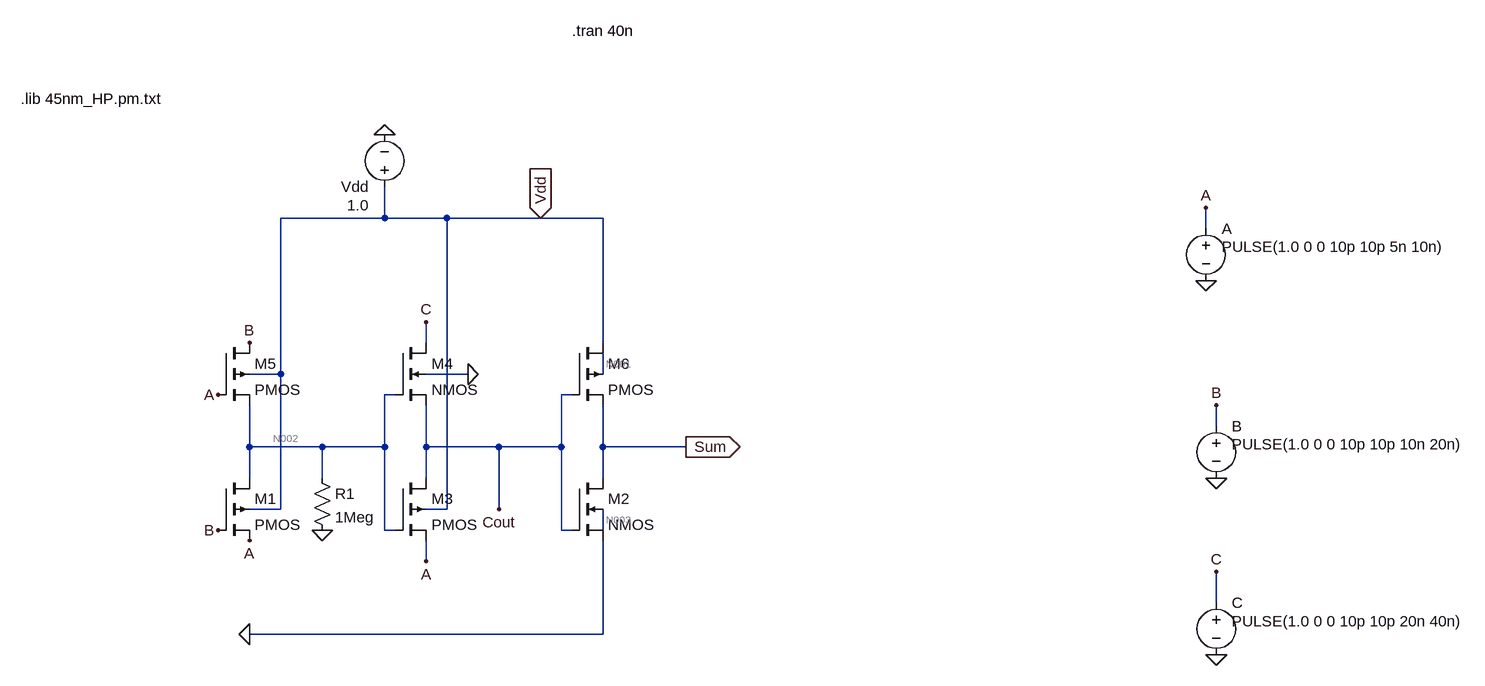
[diagram p0: schematic InXA3_45nm.asc]
InXA3_45nm.asc, the LTspice schematic file:
Version 4
SHEET 1 1044 692
WIRE -640 -240 -640 -288
WIRE -640 -240 -800 -240
WIRE -544 -240 -640 -240
WIRE -400 -240 -544 -240
WIRE -304 -240 -400 -240
WIRE 624 -224 624 -256
WIRE -576 -48 -576 -80
WIRE -304 -48 -304 -240
WIRE -800 0 -800 -240
WIRE -800 0 -848 0
WIRE -512 0 -576 0
WIRE -304 0 -304 -32
WIRE -624 32 -640 32
WIRE -352 32 -368 32
WIRE 640 80 640 48
WIRE -848 112 -848 48
WIRE -736 112 -848 112
WIRE -640 112 -640 32
WIRE -640 112 -736 112
WIRE -576 112 -576 48
WIRE -464 112 -576 112
WIRE -368 112 -368 32
WIRE -368 112 -464 112
WIRE -304 112 -304 48
WIRE -176 112 -304 112
WIRE -848 160 -848 112
WIRE -736 160 -736 112
WIRE -576 160 -576 112
WIRE -304 160 -304 112
WIRE -800 208 -800 0
WIRE -800 208 -848 208
WIRE -544 208 -544 -240
WIRE -544 208 -576 208
WIRE -464 208 -464 112
WIRE -640 240 -640 112
WIRE -624 240 -640 240
WIRE -368 240 -368 112
WIRE -352 240 -368 240
WIRE -304 240 -304 208
WIRE -576 288 -576 256
WIRE 640 352 640 304
WIRE -304 400 -304 256
WIRE -304 400 -848 400
FLAG 624 -144 0
FLAG 640 160 0
FLAG 640 432 0
FLAG 624 -256 A
FLAG 640 48 B
FLAG 640 304 C
FLAG -400 -240 Vdd
IOPIN -400 -240 In
FLAG -640 -368 0
FLAG -896 32 A
FLAG -848 256 A
FLAG -896 240 B
FLAG -848 -48 B
FLAG -576 -80 C
FLAG -848 400 0
FLAG -576 288 A
FLAG -176 112 Sum
IOPIN -176 112 Out
FLAG -736 240 0
FLAG -512 0 0
FLAG -464 208 Cout
SYMBOL voltage 624 -240 R0
WINDOW 3 24 44 Left 2
WINDOW 123 0 0 Left 0
WINDOW 39 0 0 Left 0
SYMATTR Value PULSE(1.0 0 0 10p 10p 5n 10n)
SYMATTR InstName A
SYMBOL voltage 640 64 R0
WINDOW 3 24 44 Left 2
WINDOW 123 0 0 Left 0
WINDOW 39 0 0 Left 0
SYMATTR Value PULSE(1.0 0 0 10p 10p 10n 20n)
SYMATTR InstName B
SYMBOL voltage 640 336 R0
WINDOW 3 24 44 Left 2
WINDOW 123 0 0 Left 0
WINDOW 39 0 0 Left 0
SYMATTR Value PULSE(1.0 0 0 10p 10p 20n 40n)
SYMATTR InstName C
SYMBOL voltage -640 -272 R180
WINDOW 3 24 -12 Left 2
WINDOW 123 0 0 Left 0
WINDOW 39 0 0 Left 0
SYMATTR Value 1.0
SYMATTR InstName Vdd
SYMBOL nmos4 -352 160 R0
SYMATTR InstName M2
SYMATTR Value2 l=45n w=90n
SYMBOL nmos4 -624 -48 R0
SYMATTR InstName M4
SYMATTR Value2 l=45n w=90n
SYMBOL pmos4 -896 -48 R0
SYMATTR InstName M5
SYMATTR Value2 l=45n w=180n
SYMBOL res -752 144 R0
SYMATTR InstName R1
SYMATTR Value 1Meg
SYMBOL pmos4 -896 160 R0
SYMATTR InstName M1
SYMATTR Value2 l=45n w=180n
SYMBOL pmos4 -624 160 R0
SYMATTR InstName M3
SYMATTR Value2 l=45n w=180n
SYMBOL pmos4 -352 -48 R0
SYMATTR InstName M6
SYMATTR Value2 l=45n w=180n
TEXT -1200 -424 Left 2 !.lib 45nm_HP.pm.txt
TEXT -352 -528 Left 2 !.tran 40n

The netlist it stands for:
* InXA3_45nm.asc
V§A A 0 PULSE(1.0 0 0 10p 10p 5n 10n)
V§B B 0 PULSE(1.0 0 0 10p 10p 10n 20n)
V§C C 0 PULSE(1.0 0 0 10p 10p 20n 40n)
Vdd Vdd 0 1.0
M2 Sum Cout 0 N003 NMOS l=45n w=90n
M4 C N002 Cout 0 NMOS l=45n w=90n
M5 B A N002 Vdd PMOS l=45n w=180n
R1 N002 0 1Meg
M1 N002 B A Vdd PMOS l=45n w=180n
M3 Cout N002 A Vdd PMOS l=45n w=180n
M6 Vdd Cout Sum N001 PMOS l=45n w=180n
.model NMOS NMOS
.model PMOS PMOS
.lib standard.mos
.lib 45nm_HP.pm.txt
.tran 40n
.backanno
.end

* Results of the author's LTspice run, read from the files saved beside the schematic
* Operating Point, zero values left out:
*   V(a) = 1 V
*   V(b) = 1 V
*   V(c) = 1 V
*   V(vdd) = 1 V
*   V(sum) = 5.199 µV
*   V(cout) = 1 V
*   V(n003) = 161.1 mV
*   V(n002) = 2.054 mV
*   V(n001) = 868.5 mV
*   Id(M6) = 1.881 nA
*   Ig(M6) = 124.8 pA
*   Is(M6) = -2.005 nA
*   Id(M3) = -168.3 pA
*   Ig(M3) = -253.6 pA
*   Ib(M3) = 5.111 pA
*   Is(M3) = 416.8 pA
*   Id(M1) = -887.6 pA
*   Ig(M1) = 123.8 pA
*   Ib(M1) = 1.008 pA
*   Is(M1) = 762.8 pA
*   Id(M5) = 762.8 pA
*   Ig(M5) = 123.8 pA
*   Is(M5) = -887.6 pA
*   Id(M4) = 13.7 pA
*   Ig(M4) = -25.38 pA
*   Ib(M4) = -2.01 pA
*   Is(M4) = 13.69 pA
*   Id(M2) = 2.005 nA
*   Ig(M2) = 29.87 pA
*   Is(M2) = -2.034 nA
*   I(R1) = 2.054 nA
*   I(Vdd) = -1.888 nA
*   I(C) = -13.7 pA
*   I(B) = -886.6 pA
*   I(A) = -1.303 nA
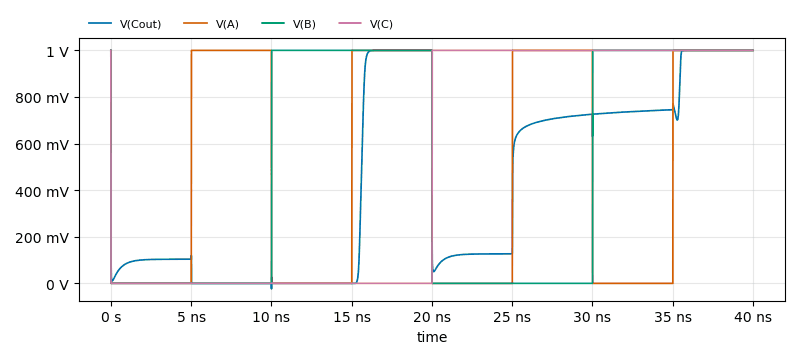
[diagram p1: Transient Analysis of InXA3_45nm.asc, plotted from the saved traces]
* Transient Analysis, 1 run:
*   V(Cout): min -23.42 mV, max 1 V, average 436.2 mV, rms 598.4 mV, last 1 V
*   V(A): min 0 V, max 1 V, average 499 mV, rms 706.2 mV, last 1 V
*   V(B): min 0 V, max 1 V, average 499.5 mV, rms 706.6 mV, last 1 V
*   V(C): min 0 V, max 1 V, average 499.7 mV, rms 706.9 mV, last 1 V